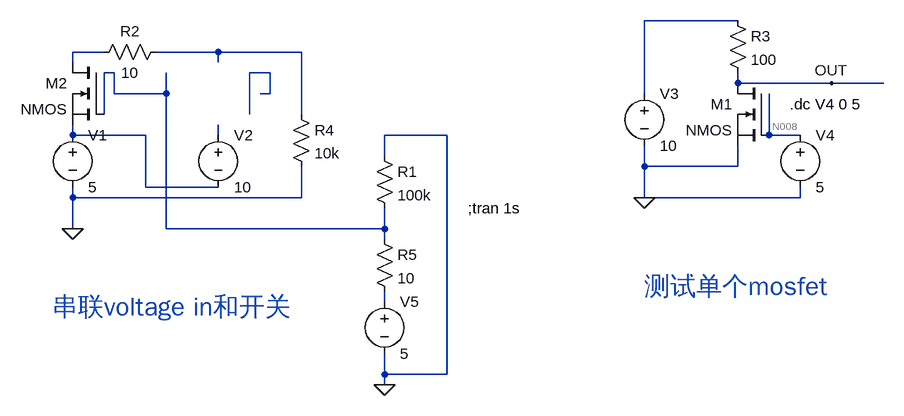
[diagram p0: schematic series power supply.asc]
series power supply.asc, the LTspice schematic file:
Version 4
SHEET 1 1096 680
WIRE 832 -112 688 -112
WIRE -144 -64 -192 -64
WIRE 32 -64 -64 -64
WIRE 160 -64 32 -64
WIRE -192 -48 -192 -64
WIRE 32 -48 32 -64
WIRE -128 -32 -144 -32
WIRE 112 -32 80 -32
WIRE 832 -16 832 -32
WIRE 976 -16 832 -16
WIRE 1056 -16 976 -16
WIRE -128 0 -128 -32
WIRE -48 0 -48 -32
WIRE -48 0 -128 0
WIRE 112 0 112 -32
WIRE 112 0 96 0
WIRE 688 0 688 -112
WIRE -144 32 -144 -32
WIRE 80 32 80 -32
WIRE 160 32 160 -64
WIRE -192 64 -192 48
WIRE -80 64 -192 64
WIRE 32 64 32 48
WIRE 384 64 288 64
WIRE 880 64 880 0
WIRE 928 64 880 64
WIRE 288 96 288 64
WIRE 688 112 688 80
WIRE 832 112 832 80
WIRE 832 112 688 112
WIRE -80 144 -80 64
WIRE 32 144 -80 144
WIRE -192 160 -192 144
WIRE 160 160 160 112
WIRE 160 160 -192 160
WIRE 688 160 688 112
WIRE 928 160 928 144
WIRE 928 160 688 160
WIRE -192 208 -192 160
WIRE -48 208 -48 0
WIRE 288 208 288 176
WIRE 288 208 -48 208
WIRE 288 224 288 208
WIRE 288 320 288 304
WIRE 288 432 288 400
WIRE 384 432 384 64
WIRE 384 432 288 432
WIRE 288 448 288 432
FLAG -192 208 0
FLAG 688 160 0
FLAG 976 -16 OUT
FLAG 288 448 0
DATAFLAG 112 -64 ""
DATAFLAG 288 208 ""
SYMBOL voltage -192 48 R0
WINDOW 123 0 0 Left 0
WINDOW 39 0 0 Left 0
SYMATTR InstName V1
SYMATTR Value 5
SYMBOL voltage 32 48 R0
WINDOW 123 0 0 Left 0
WINDOW 39 0 0 Left 0
SYMATTR InstName V2
SYMATTR Value 10
SYMBOL res 272 80 R0
SYMATTR InstName R1
SYMATTR Value 100k
SYMBOL res -48 -80 R90
WINDOW 0 0 56 VBottom 2
WINDOW 3 32 56 VTop 2
SYMATTR InstName R2
SYMATTR Value 10
SYMBOL voltage 688 -16 R0
WINDOW 123 0 0 Left 0
WINDOW 39 0 0 Left 0
SYMATTR InstName V3
SYMATTR Value 10
SYMBOL res 816 -128 R0
SYMATTR InstName R3
SYMATTR Value 100
SYMBOL voltage 928 48 R0
WINDOW 123 0 0 Left 0
WINDOW 39 0 0 Left 0
SYMATTR InstName V4
SYMATTR Value 5
SYMBOL res 144 16 R0
SYMATTR InstName R4
SYMATTR Value 10k
SYMBOL voltage 288 304 R0
WINDOW 123 0 0 Left 0
WINDOW 39 0 0 Left 0
SYMATTR InstName V5
SYMATTR Value 5
SYMBOL res 272 208 R0
SYMATTR InstName R5
SYMATTR Value 10
SYMBOL nmos -144 -48 M0
SYMATTR InstName M2
SYMBOL nmos 880 -16 M0
SYMATTR InstName M1
TEXT 416 176 Left 2 !;tran 1s
TEXT 688 296 Left 4 ;测试单个mosfet
TEXT -224 328 Left 4 ;串联voltage in和开关
TEXT 912 16 Left 2 !.dc V4 0 5

The netlist it stands for:
* series power supply.asc
V1 N006 0 5
V2 N007 N006 10
R1 0 N004 100k
R2 N003 N002 10
V3 N001 0 10
R3 N001 OUT 100
V4 N008 0 5
R4 N003 0 10k
V5 N009 0 5
R5 N004 N009 10
M2 N002 N004 N006 N006 NMOS
M1 OUT N008 0 0 NMOS
.model NMOS NMOS
.model PMOS PMOS
.lib standard.mos
;tran 1s
* 测试单个mosfet
* 串联voltage in和开关
.dc V4 0 5
.backanno
.end

* Results of the author's LTspice run, read from the files saved beside the schematic
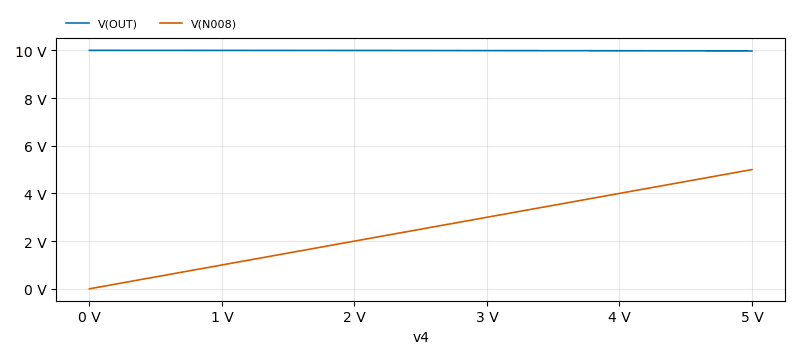
[diagram p1: DC transfer characteristic of series power supply.asc, plotted from the saved traces]
* DC transfer characteristic, 1 run:
*   V(OUT): 10 V at v4=0 V, 9.975 V at v4=5 V, min 9.975 V, max 10 V
*   V(N008): 0 V at v4=0 V, 5 V at v4=5 V, min 0 V, max 5 V